# Altium schematic sheet Crystal.SchDoc
size A4; SheetNumber: 5; SheetTotal: 5
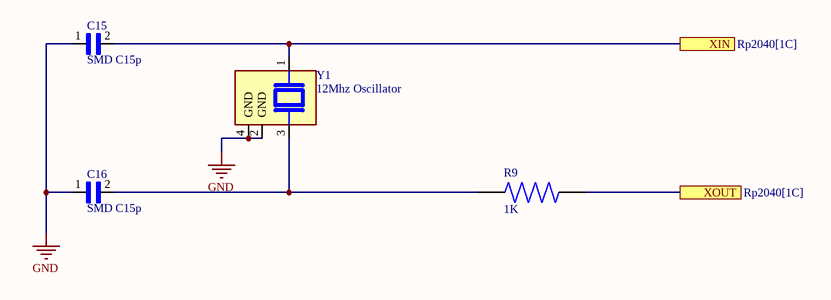
[diagram p0: Crystal.SchDoc]

## Parts
C15  SMD C15p  [SMD Capacetor-Footprint-1]
C16  SMD C15p  [SMD Capacetor-Footprint-1]
R9  1K  [SMD Resistor-Footprint-1]
Y1  12Mhz Oscillator  [12Mhz Oscillator-Footprint-1]

## Ports
XIN (see Rp2040[1C]), XOUT (see Rp2040[1C])

## Nets
GND: C15.1 C16.1 Y1.2(GND) Y1.4(GND)
XIN: C15.2 Y1.1 ; port XIN
XOUT: R9.2 ; port XOUT
NetC16_2: C16.2 R9.1 Y1.3

## Library data of the parts
C15 C16 = CMP-00051-2: Generic SMD Capacetor
R9 = CMP-00019-4: Generic SMD Resistor
Y1 = CMP-00003-1: 12 Mhz Oscillator SMD